# Altium schematic sheet ETR_CELLMETER_MASTER.SchDoc
size A3; DocumentNumber: 1; SheetNumber: 1; SheetTotal: 6
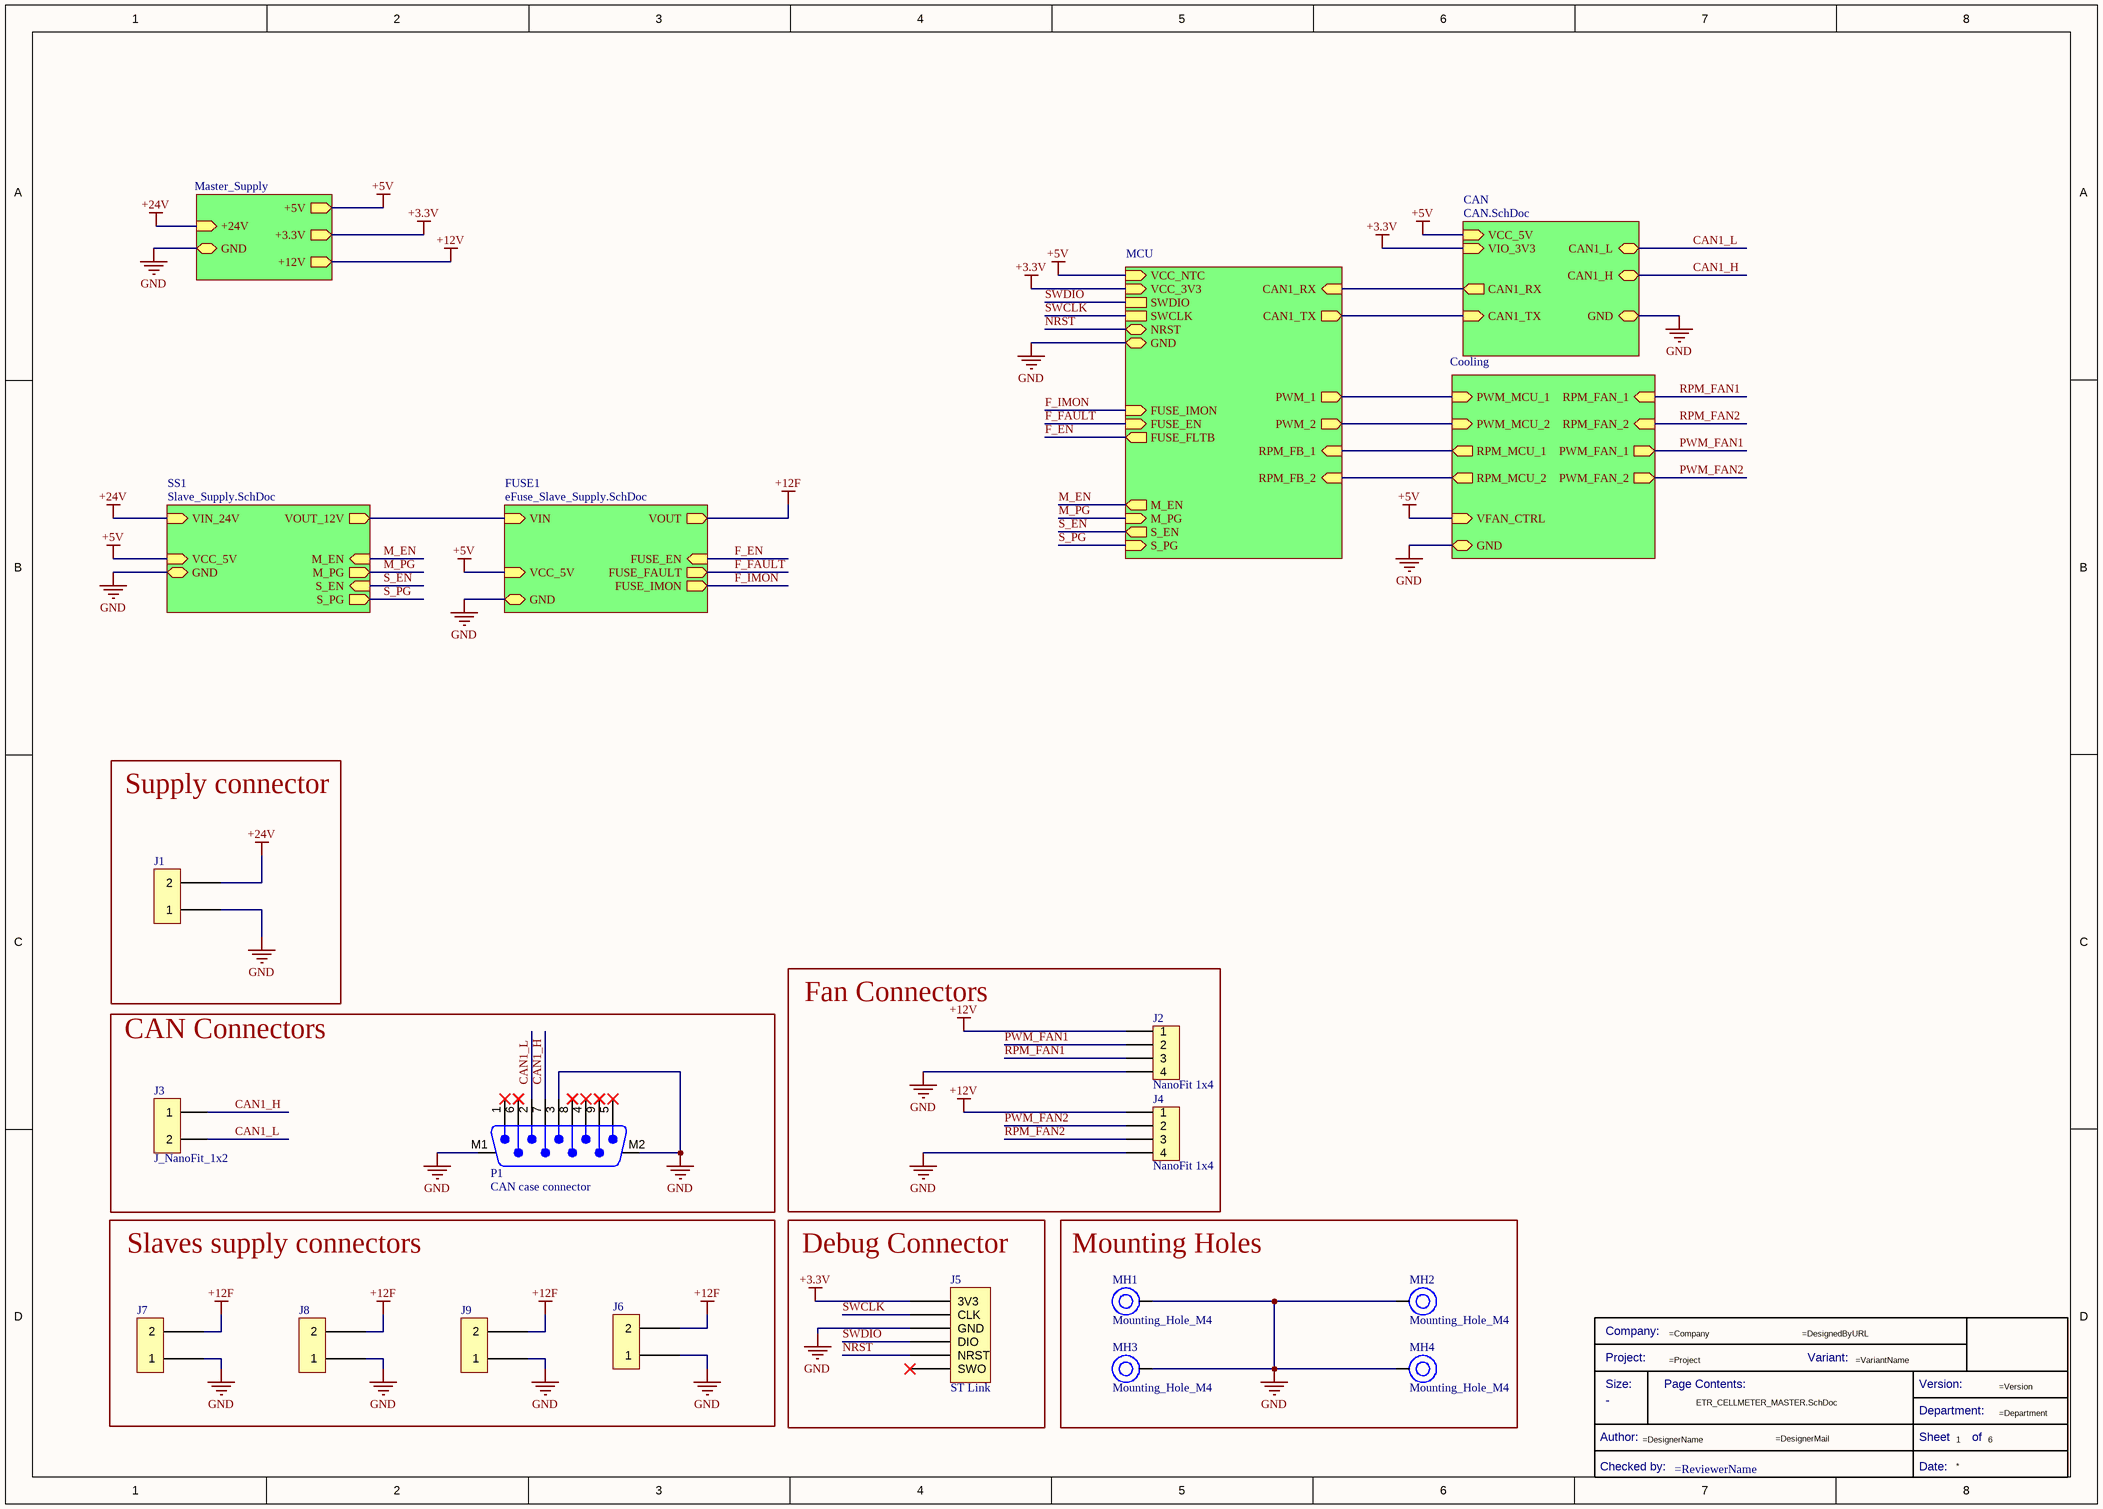
[diagram p0: ETR_CELLMETER_MASTER.SchDoc]

## Parts
*  Title Block_template  (value not drawn)  (graphical)
J1  J_2x1_14A_TE  [179838-2]  (value not drawn)
J2  NanoFit 1x4  [J_NanoFit_1x4_V]
J3  J_NanoFit_1x2  [FP-105309-1102-MFG]
J4  NanoFit 1x4  [J_NanoFit_1x4_V]
J5  ST Link  [J_STLink_PinHeader]
J6  J_2x1_14A_TE  [179838-2]  (value not drawn)
J7  J_2x1_14A_TE  [179838-2]  (value not drawn)
J8  J_2x1_14A_TE  [179838-2]  (value not drawn)
J9  J_2x1_14A_TE  [179838-2]  (value not drawn)
MH1  Mounting_Hole_M4  [Mounting_Hole_M4]
MH2  Mounting_Hole_M4  [Mounting_Hole_M4]
MH3  Mounting_Hole_M4  [Mounting_Hole_M4]
MH4  Mounting_Hole_M4  [Mounting_Hole_M4]
P1  CAN case connector  [618009231221]

## Blocks framed on the sheet
Supply connector: J1
Fan Connectors: J2 J4
CAN Connectors: J3 P1
Slaves supply connectors: J6-J9
Debug Connector: J5
Mounting Holes: MH1-MH4

## Sub-sheets
CAN = CAN.SchDoc: CAN1_L (bidir), CAN1_H (bidir), VCC_5V (in), VIO_3V3 (in), CAN1_RX (out), CAN1_TX (in), GND (bidir)
Cooling = Cooling: PWM_MCU_1 (in), PWM_MCU_2 (in), PWM_FAN_1 (out), PWM_FAN_2 (out), RPM_FAN_1 (in), RPM_FAN_2 (in), RPM_MCU_1 (out), RPM_MCU_2 (out), VFAN_CTRL (in), GND (bidir)
FUSE1 = eFuse_Slave_Supply.SchDoc: VIN (in), VOUT (out), FUSE_EN (in), FUSE_FAULT (out), FUSE_IMON (out), VCC_5V (in), GND (bidir)
Master_Supply = Master_Supply: +24V (in), +5V (out), +3.3V (out), +12V (out), GND (bidir)
MCU = MCU: VCC_3V3 (in), SWDIO, SWCLK, PWM_1 (out), PWM_2 (out), RPM_FB_1 (in), RPM_FB_2 (in), CAN1_TX (out), CAN1_RX (in), NRST (bidir), GND (bidir), VCC_NTC (in), M_EN (out), M_PG (in), S_EN (out), S_PG (in), FUSE_IMON (in), FUSE_EN (in), FUSE_FLTB (out)
SS1 = Slave_Supply.SchDoc: VIN_24V (in), VOUT_12V (out), VCC_5V (in), GND (bidir), M_PG (out), M_EN (in), S_PG (out), S_EN (in)

## Nets
+3.3V: J5.1(3V3) ; sheet Master_Supply/+3.3V, sheet MCU/VCC_3V3, sheet CAN/VIO_3V3
+5V: sheet Master_Supply/+5V, sheet MCU/VCC_NTC, sheet Cooling/VFAN_CTRL, sheet SS1/VCC_5V, sheet FUSE1/VCC_5V, sheet CAN/VCC_5V
+12F: J6.2 J7.2 J8.2 J9.2 ; sheet FUSE1/VOUT
+12V: J2.1 J4.1 ; sheet Master_Supply/+12V
+24V: J1.2 ; sheet Master_Supply/+24V, sheet SS1/VIN_24V
GND: J1.1 J2.4 J4.4 J5.3(GND) J6.1 J7.1 J8.1 J9.1 MH1.1 MH2.1 MH3.1 MH4.1 P1.3 P1.M1 P1.M2 ; sheet Master_Supply/GND, sheet MCU/GND, sheet Cooling/GND, sheet SS1/GND, sheet FUSE1/GND, sheet CAN/GND
CAN1_H: J3.1 P1.7 ; sheet CAN/CAN1_H
CAN1_L: J3.2 P1.2 ; sheet CAN/CAN1_L
F_EN: sheet MCU/FUSE_FLTB, sheet FUSE1/FUSE_EN
F_FAULT: sheet MCU/FUSE_EN, sheet FUSE1/FUSE_FAULT
F_IMON: sheet MCU/FUSE_IMON, sheet FUSE1/FUSE_IMON
M_EN: sheet MCU/M_EN, sheet SS1/M_EN
M_PG: sheet MCU/M_PG, sheet SS1/M_PG
NRST: J5.5(NRST) ; sheet MCU/NRST
PWM_FAN1: J2.2 ; sheet Cooling/PWM_FAN_1
PWM_FAN2: J4.2 ; sheet Cooling/PWM_FAN_2
RPM_FAN1: J2.3 ; sheet Cooling/RPM_FAN_1
RPM_FAN2: J4.3 ; sheet Cooling/RPM_FAN_2
S_EN: sheet MCU/S_EN, sheet SS1/S_EN
S_PG: sheet MCU/S_PG, sheet SS1/S_PG
SWCLK: J5.2(CLK) ; sheet MCU/SWCLK
SWDIO: J5.4(DIO) ; sheet MCU/SWDIO
(unnamed): sheet MCU/PWM_1, sheet Cooling/PWM_MCU_1
(unnamed): sheet MCU/PWM_2, sheet Cooling/PWM_MCU_2
(unnamed): sheet MCU/RPM_FB_1, sheet Cooling/RPM_MCU_1
(unnamed): sheet MCU/RPM_FB_2, sheet Cooling/RPM_MCU_2
(unnamed): sheet MCU/CAN1_TX, sheet CAN/CAN1_TX
(unnamed): sheet MCU/CAN1_RX, sheet CAN/CAN1_RX
(unnamed): sheet SS1/VOUT_12V, sheet FUSE1/VIN

Not connected (* = marked no-connect by the designer): J5 6(SWO)*; P1 1* 4* 5* 6* 8* 9*

## Notes on the sheet
- THIS DOCUMENT AND THE DATA DISCLOSED HEREIN OR
- HEREWITH IS THE PROPERTY OF ALTIUM LIMITED AND MAY
- DWG NO:
- REVISION
- REV:
- DESCRIPTION
- DATE
- APPROVED
- BE FREELY DISTRIBUTED IN WHOLE. NO RIGHTS ARE
- RESERVED OR EXPRESS OR IMPLIED WARANTEE GIVEN.
- ENG:
- APPROVALS
- PROJECT
- DSN:
- CHK:
- REFERENCE DOCUMENTS
- PROJECT REVISION:
- TITLE
- DOCUMENT REVISION:
- DESIGN ITEM:
- BOM:
- FAB DWG:
- PCB DWG:
- ASSY DWG:
- SCALE:
- A3
- SIZE
- CAGE CODE
- FILE NAME
- DWG NO.
- SHEET
- OF
- REV
- (in symbol Title Block_template) Company:; Project:; Variant:; Size:; Page Contents:; Version:; Department:; Author:; Sheet; of; Checked by:; Date:

## Library data of the parts
* = Title Block_template: Standard Title Block; .Creator: GP; Category: Title Block; .PCBcheck: GP; .SCHcheck: GP; Checked by:: =ReviewerName; Size: -
J1 J6-J9 = CMP-002-00003-2: 179838-2; Connector Type: Power,Rectangular; Design Item ID: Power 2 pin connector; Mounting Technology: Board; RoHS Compliant: Yes; Max Operating Temperature: 105°C; Source: Electromechanical.SchLib; Min Operating Temperature: -30°C
J2 J4 = CMP-00027-1: Conn HDR 4 POS 2.5mm Solder ST Thru-Hole 4 Terminal 1 Port Nano-Fit Tray; Manufacturer Part Number 1: 105309-2104; Manufacturer 1: Molex; .Creator: DR; Stock 1: 1183; RoHS: No; Category: Headers and Wire Housings; Source: Electromechanical.SchLib; Design Item ID: J_NanoFit_1x4_V_W; Pricing 1: 1=1,30000, 10=1,15000, 25=1,11000, 50=1,07000, 100=1,02000, 250=0,94400 (USD)
J3 = CMP-002-00001-2: Conn HDR 2 POS 2.5mm Solder ST Thru-Hole 2 Terminal 1 Port Nano-Fit Tray
J5 = J_STLink_STM32_PinHeader_1x6
MH1-MH4 = CMP-00041-6: Mounting Hole M4; Source: Electromechanical.SchLib; Design Item ID: Mounting_Hole_M4
P1 = CMP-002-00005-1: D Type Connector, 9 Contact(s), Male, Solder Terminal, Locking, Receptacle; RoHS Compliant: Yes; Max Operating Temperature: 85°C; Mounting Technology: Board; Min Operating Temperature: -40°C